# Altium schematic sheet switch_v2.SchDoc
size 406 x 304 mm
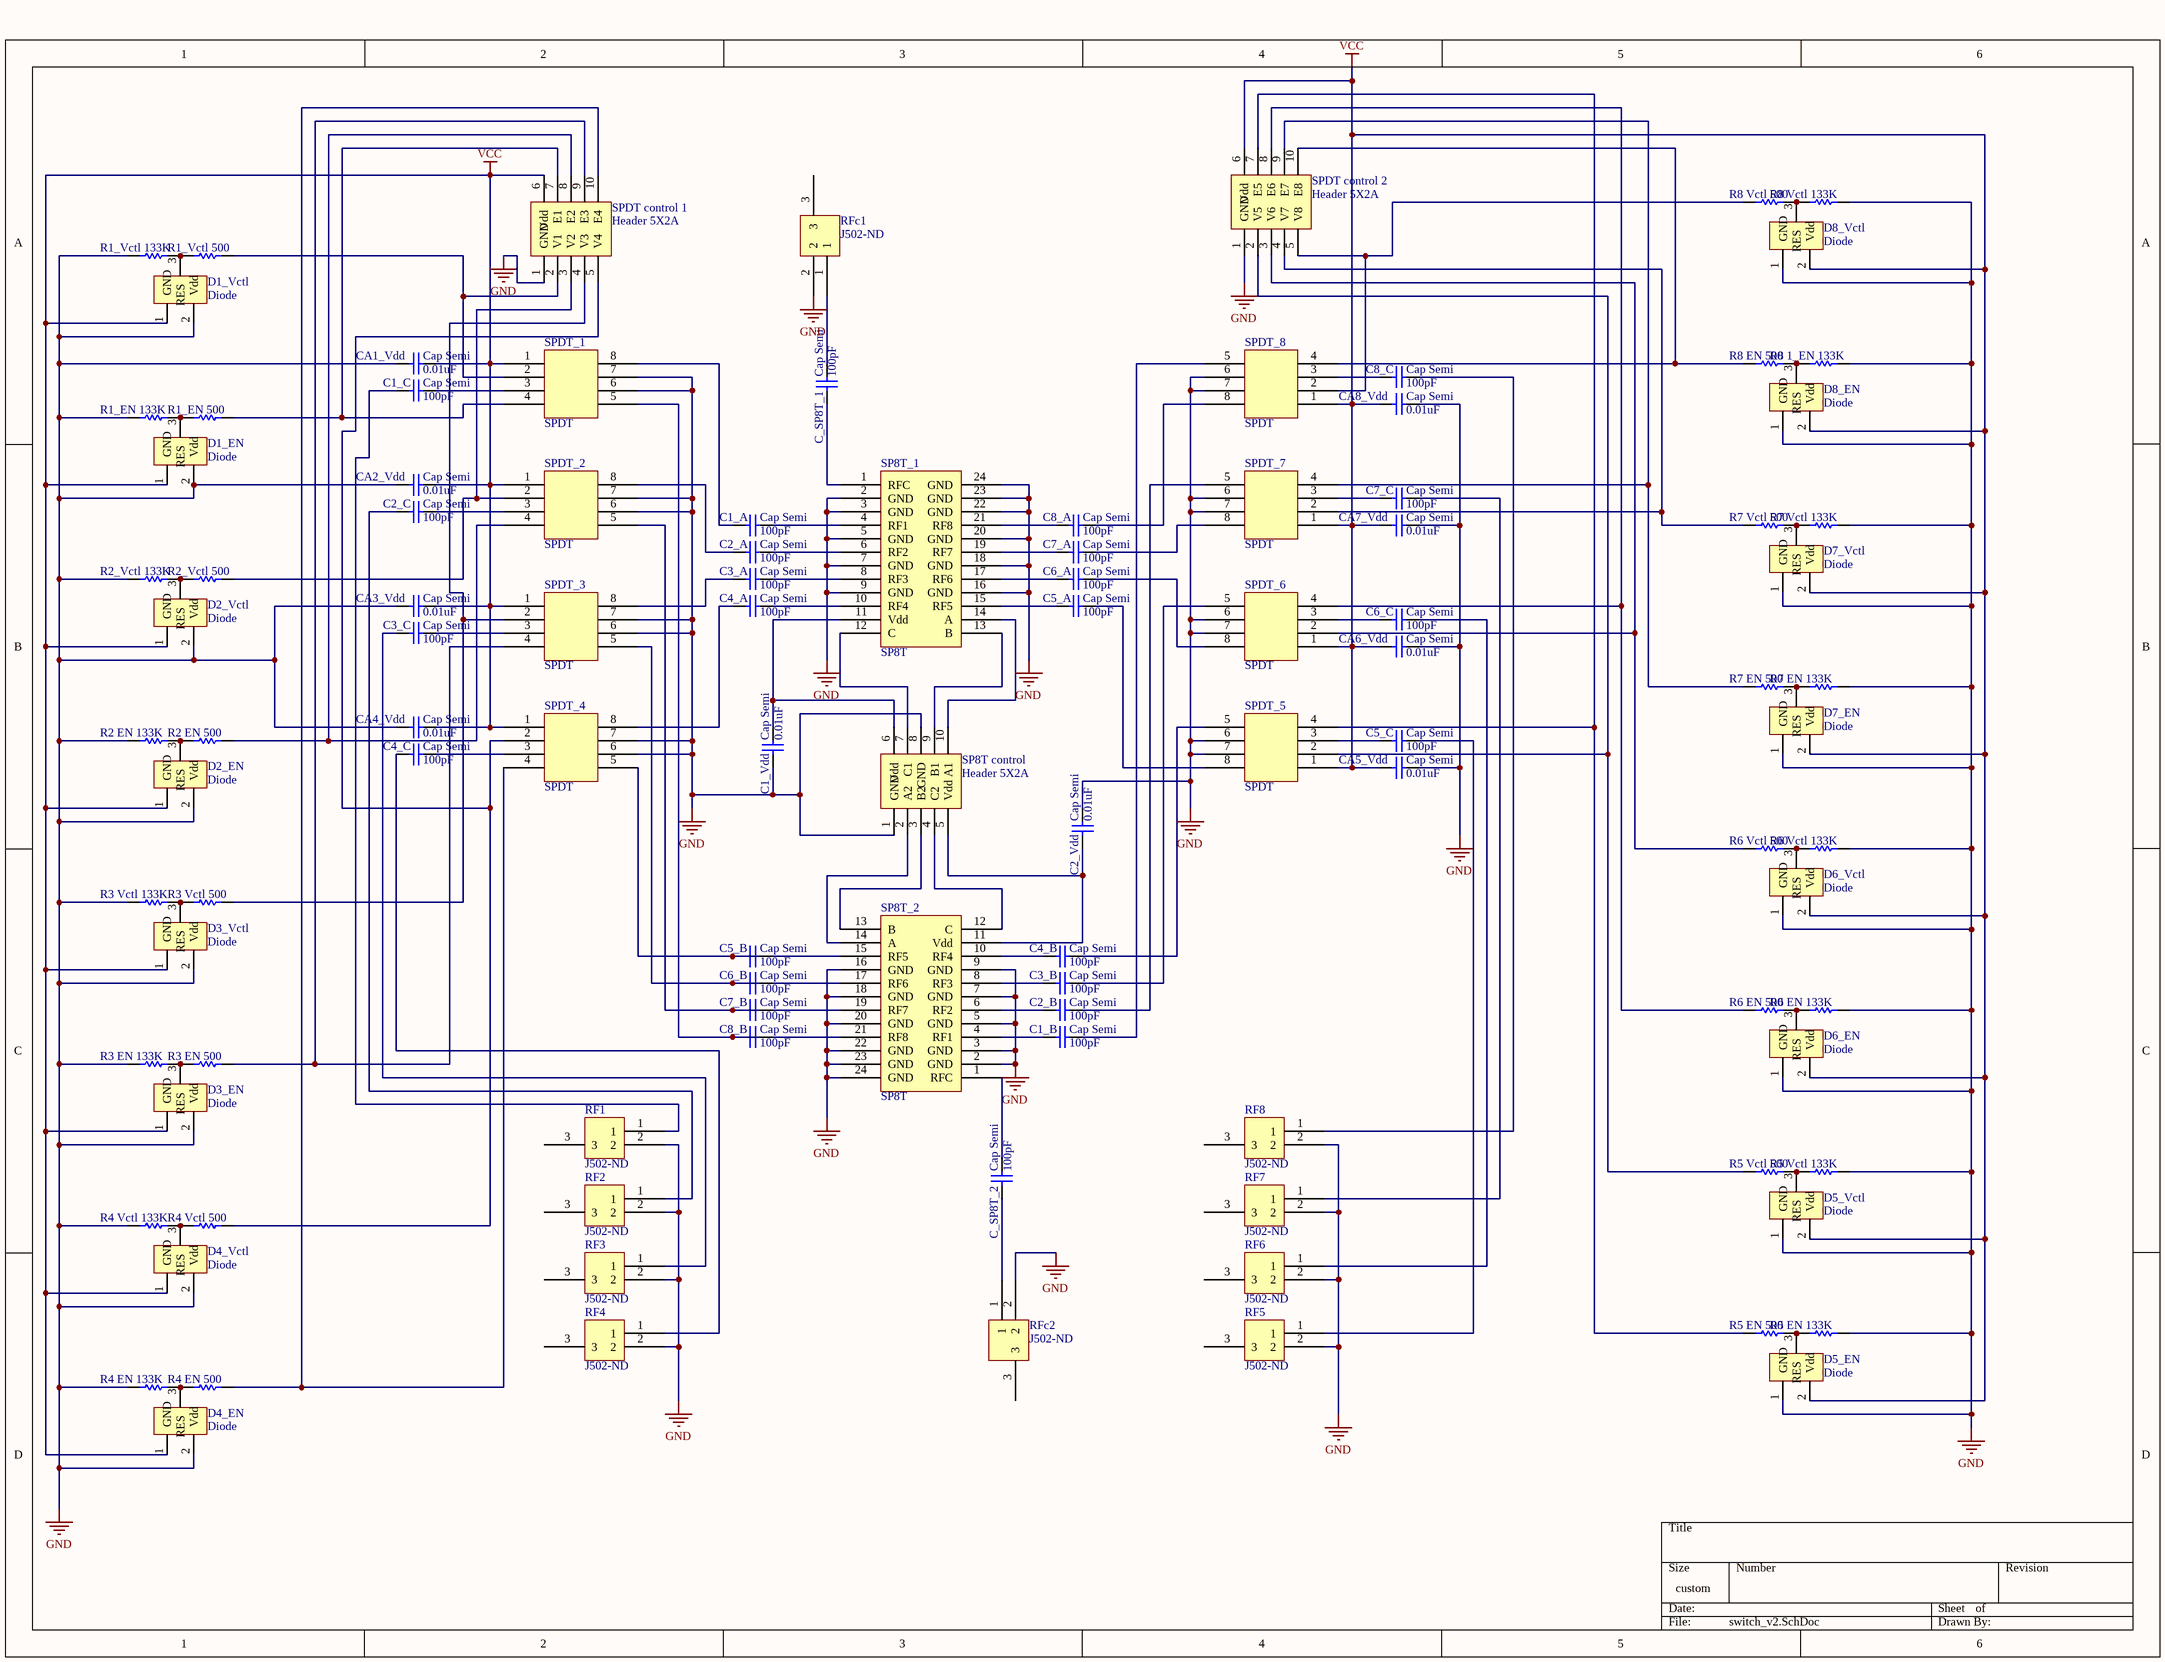
[diagram p0: switch_v2.SchDoc]

## Parts
C1_A  Cap Semi  value 100pF  [0402]
C1_B  Cap Semi  value 100pF  [0402]
C1_C  Cap Semi  value 100pF  [0402]
C1_Vdd  Cap Semi  value 0.01uF  [1608[0603]]
C2_A  Cap Semi  value 100pF  [0402]
C2_B  Cap Semi  value 100pF  [0402]
C2_C  Cap Semi  value 100pF  [0402]
C2_Vdd  Cap Semi  value 0.01uF  [1608[0603]]
C3_A  Cap Semi  value 100pF  [0402]
C3_B  Cap Semi  value 100pF  [0402]
C3_C  Cap Semi  value 100pF  [0402]
C4_A  Cap Semi  value 100pF  [0402]
C4_B  Cap Semi  value 100pF  [0402]
C4_C  Cap Semi  value 100pF  [0402]
C5_A  Cap Semi  value 100pF  [0402]
C5_B  Cap Semi  value 100pF  [0402]
C5_C  Cap Semi  value 100pF  [0402]
C6_A  Cap Semi  value 100pF  [0402]
C6_B  Cap Semi  value 100pF  [0402]
C6_C  Cap Semi  value 100pF  [0402]
C7_A  Cap Semi  value 100pF  [0402]
C7_B  Cap Semi  value 100pF  [0402]
C7_C  Cap Semi  value 100pF  [0402]
C8_A  Cap Semi  value 100pF  [0402]
C8_B  Cap Semi  value 100pF  [0402]
C8_C  Cap Semi  value 100pF  [0402]
C_SP8T_1  Cap Semi  value 100pF  [0402]
C_SP8T_2  Cap Semi  value 100pF  [0402]
CA1_Vdd  Cap Semi  value 0.01uF  [1608[0603]]
CA2_Vdd  Cap Semi  value 0.01uF  [1608[0603]]
CA3_Vdd  Cap Semi  value 0.01uF  [1608[0603]]
CA4_Vdd  Cap Semi  value 0.01uF  [1608[0603]]
CA5_Vdd  Cap Semi  value 0.01uF  [1608[0603]]
CA6_Vdd  Cap Semi  value 0.01uF  [1608[0603]]
CA7_Vdd  Cap Semi  value 0.01uF  [1608[0603]]
CA8_Vdd  Cap Semi  value 0.01uF  [1608[0603]]
D1_EN  Diode  [SOT-23_N]
D1_Vctl  Diode  [SOT-23_N]
D2_EN  Diode  [SOT-23_N]
D2_Vctl  Diode  [SOT-23_N]
D3_EN  Diode  [SOT-23_N]
D3_Vctl  Diode  [SOT-23_N]
D4_EN  Diode  [SOT-23_N]
D4_Vctl  Diode  [SOT-23_N]
D5_EN  Diode  [SOT-23_N]
D5_Vctl  Diode  [SOT-23_N]
D6_EN  Diode  [SOT-23_N]
D6_Vctl  Diode  [SOT-23_N]
D7_EN  Diode  [SOT-23_N]
D7_Vctl  Diode  [SOT-23_N]
D8_EN  Diode  [SOT-23_N]
D8_Vctl  Diode  [SOT-23_N]
R1_EN_133K  (no value)  [0402]
R1_EN_500  (no value)  [0402]
R1_Vctl_133K  (no value)  [0402]
R1_Vctl_500  (no value)  [0402]
R2_EN_133K  (no value)  [0402]
R2_EN_500  (no value)  [0402]
R2_Vctl_133K  (no value)  [0402]
R2_Vctl_500  (no value)  [0402]
R3_EN_133K  (no value)  [0402]
R3_EN_500  (no value)  [0402]
R3_Vctl_133K  (no value)  [0402]
R3_Vctl_500  (no value)  [0402]
R4_EN_133K  (no value)  [0402]
R4_EN_500  (no value)  [0402]
R4_Vctl_133K  (no value)  [0402]
R4_Vctl_500  (no value)  [0402]
R5_EN_133K  (no value)  [0402]
R5_EN_500  (no value)  [0402]
R5_Vctl_133K  (no value)  [0402]
R5_Vctl_500  (no value)  [0402]
R6_EN_133K  (no value)  [0402]
R6_EN_500  (no value)  [0402]
R6_Vctl_133K  (no value)  [0402]
R6_Vctl_500  (no value)  [0402]
R7_EN_133K  (no value)  [0402]
R7_EN_500  (no value)  [0402]
R7_Vctl_133K  (no value)  [0402]
R7_Vctl_500  (no value)  [0402]
R8_1_EN_133K  (no value)  [0402]
R8_EN_500  (no value)  [0402]
R8_Vctl_133K  (no value)  [0402]
R8_Vctl_500  (no value)  [0402]
RF1  J502-ND  [J502-ND]
RF2  J502-ND  [J502-ND]
RF3  J502-ND  [J502-ND]
RF4  J502-ND  [J502-ND]
RF5  J502-ND  [J502-ND]
RF6  J502-ND  [J502-ND]
RF7  J502-ND  [J502-ND]
RF8  J502-ND  [J502-ND]
RFc1  J502-ND  [J502-ND]
RFc2  J502-ND  [J502-ND]
SP8T_1  SP8T  [SP8T]
SP8T_2  SP8T  [SP8T]
SP8T_control  Header 5X2A  [HDR2X5_CEN]
SPDT_1  SPDT  [SPDT]
SPDT_2  SPDT  [SPDT]
SPDT_3  SPDT  [SPDT]
SPDT_4  SPDT  [SPDT]
SPDT_5  SPDT  [SPDT]
SPDT_6  SPDT  [SPDT]
SPDT_7  SPDT  [SPDT]
SPDT_8  SPDT  [SPDT]
SPDT_control_1  Header 5X2A  [HDR2X5_CEN]
SPDT_control_2  Header 5X2A  [HDR2X5_CEN]

## Nets
GND: C1_Vdd.1 C2_Vdd.2 CA1_Vdd.2 CA2_Vdd.2 CA3_Vdd.2 CA4_Vdd.2 CA5_Vdd.1 CA6_Vdd.1 CA7_Vdd.1 CA8_Vdd.1 D1_EN.2(Vdd) D1_Vctl.2(Vdd) D2_EN.2(Vdd) D2_Vctl.2(Vdd) D3_EN.2(Vdd) D3_Vctl.2(Vdd) D4_EN.2(Vdd) D4_Vctl.2(Vdd) D5_EN.1(GND) D5_Vctl.1(GND) D6_EN.1(GND) D6_Vctl.1(GND) D7_EN.1(GND) D7_Vctl.1(GND) D8_EN.1(GND) D8_Vctl.1(GND) R1_EN_133K.1 R1_Vctl_133K.1 R2_EN_133K.1 R2_Vctl_133K.1 R3_EN_133K.1 R3_Vctl_133K.1 R4_EN_133K.1 R4_Vctl_133K.1 R5_EN_133K.2 R5_Vctl_133K.2 R6_EN_133K.2 R6_Vctl_133K.2 R7_EN_133K.2 R7_Vctl_133K.2 R8_1_EN_133K.2 R8_Vctl_133K.2 RF1.2 RF2.2 RF3.2 RF4.2 RF5.2 RF6.2 RF7.2 RF8.2 RFc1.2 RFc2.2 SP8T_1.2(GND) SP8T_1.3(GND) SP8T_1.5(GND) SP8T_1.7(GND) SP8T_1.9(GND) SP8T_1.16(GND) SP8T_1.18(GND) SP8T_1.20(GND) SP8T_1.22(GND) SP8T_1.23(GND) SP8T_1.24(GND) SP8T_2.2(GND) SP8T_2.3(GND) SP8T_2.5(GND) SP8T_2.7(GND) SP8T_2.9(GND) SP8T_2.16(GND) SP8T_2.18(GND) SP8T_2.20(GND) SP8T_2.22(GND) SP8T_2.23(GND) SP8T_2.24(GND) SP8T_control.1(GND) SP8T_control.8(GND) SPDT_1.6(GND) SPDT_1.7(GND) SPDT_2.6(GND) SPDT_2.7(GND) SPDT_3.6(GND) SPDT_3.7(GND) SPDT_4.6(GND) SPDT_4.7(GND) SPDT_5.6(GND) SPDT_5.7(GND) SPDT_6.6(GND) SPDT_6.7(GND) SPDT_7.6(GND) SPDT_7.7(GND) SPDT_8.6(GND) SPDT_8.7(GND) SPDT_control_1.1(GND) SPDT_control_2.1(GND)
VCC: CA1_Vdd.1 CA2_Vdd.1 CA3_Vdd.1 CA4_Vdd.1 CA5_Vdd.2 CA6_Vdd.2 CA7_Vdd.2 CA8_Vdd.2 D1_EN.1(GND) D1_Vctl.1(GND) D2_EN.1(GND) D2_Vctl.1(GND) D3_EN.1(GND) D3_Vctl.1(GND) D4_EN.1(GND) D4_Vctl.1(GND) D5_EN.2(Vdd) D5_Vctl.2(Vdd) D6_EN.2(Vdd) D6_Vctl.2(Vdd) D7_EN.2(Vdd) D7_Vctl.2(Vdd) D8_EN.2(Vdd) D8_Vctl.2(Vdd) SPDT_1.1(Vdd) SPDT_2.1(Vdd) SPDT_3.1(Vdd) SPDT_4.1(Vdd) SPDT_5.1(Vdd) SPDT_6.1(Vdd) SPDT_7.1(Vdd) SPDT_8.1(Vdd) SPDT_control_1.6(Vdd) SPDT_control_2.6(Vdd)
NetC1_A_1: C1_A.1 SPDT_1.8(RF2)
NetC1_A_2: C1_A.2 SP8T_1.4(RF1)
NetC1_B_1: C1_B.1 SP8T_2.4(RF1)
NetC1_B_2: C1_B.2 SPDT_8.5(RF1)
NetC1_C_1: C1_C.1 RF1.1
NetC1_C_2: C1_C.2 SPDT_1.3(RFC)
NetC1_Vdd_2: C1_Vdd.2 SP8T_1.11(Vdd) SP8T_control.6(Vdd)
NetC2_A_1: C2_A.1 SPDT_2.8(RF2)
NetC2_A_2: C2_A.2 SP8T_1.6(RF2)
NetC2_B_1: C2_B.1 SP8T_2.6(RF2)
NetC2_B_2: C2_B.2 SPDT_7.5(RF1)
NetC2_C_1: C2_C.1 RF2.1
NetC2_C_2: C2_C.2 SPDT_2.3(RFC)
NetC2_Vdd_1: C2_Vdd.1 SP8T_2.11(Vdd) SP8T_control.5(Vdd)
NetC3_A_1: C3_A.1 SPDT_3.8(RF2)
NetC3_A_2: C3_A.2 SP8T_1.8(RF3)
NetC3_B_1: C3_B.1 SP8T_2.8(RF3)
NetC3_B_2: C3_B.2 SPDT_6.5(RF1)
NetC3_C_1: C3_C.1 RF3.1
NetC3_C_2: C3_C.2 SPDT_3.3(RFC)
NetC4_A_1: C4_A.1 SPDT_4.8(RF2)
NetC4_A_2: C4_A.2 SP8T_1.10(RF4)
NetC4_B_1: C4_B.1 SP8T_2.10(RF4)
NetC4_B_2: C4_B.2 SPDT_5.5(RF1)
NetC4_C_1: C4_C.1 RF4.1
NetC4_C_2: C4_C.2 SPDT_4.3(RFC)
NetC5_A_1: C5_A.1 SP8T_1.15(RF5)
NetC5_A_2: C5_A.2 SPDT_5.8(RF2)
NetC5_B_1: C5_B.1 SPDT_4.5(RF1)
NetC5_B_2: C5_B.2 SP8T_2.15(RF5)
NetC5_C_1: C5_C.1 SPDT_5.3(RFC)
NetC5_C_2: C5_C.2 RF5.1
NetC6_A_1: C6_A.1 SP8T_1.17(RF6)
NetC6_A_2: C6_A.2 SPDT_6.8(RF2)
NetC6_B_1: C6_B.1 SPDT_3.5(RF1)
NetC6_B_2: C6_B.2 SP8T_2.17(RF6)
NetC6_C_1: C6_C.1 SPDT_6.3(RFC)
NetC6_C_2: C6_C.2 RF6.1
NetC7_A_1: C7_A.1 SP8T_1.19(RF7)
NetC7_A_2: C7_A.2 SPDT_7.8(RF2)
NetC7_B_1: C7_B.1 SPDT_2.5(RF1)
NetC7_B_2: C7_B.2 SP8T_2.19(RF7)
NetC7_C_1: C7_C.1 SPDT_7.3(RFC)
NetC7_C_2: C7_C.2 RF7.1
NetC8_A_1: C8_A.1 SP8T_1.21(RF8)
NetC8_A_2: C8_A.2 SPDT_8.8(RF2)
NetC8_B_1: C8_B.1 SPDT_1.5(RF1)
NetC8_B_2: C8_B.2 SP8T_2.21(RF8)
NetC8_C_1: C8_C.1 SPDT_8.3(RFC)
NetC8_C_2: C8_C.2 RF8.1
NetC_SP8T_1_1: C_SP8T_1.1 SP8T_1.1(RFC)
NetC_SP8T_1_2: C_SP8T_1.2 RFc1.1
NetC_SP8T_2_1: C_SP8T_2.1 RFc2.1
NetC_SP8T_2_2: C_SP8T_2.2 SP8T_2.1(RFC)
NetD1_EN_3: D1_EN.3(RES) R1_EN_133K.2 R1_EN_500.1
NetD1_Vctl_3: D1_Vctl.3(RES) R1_Vctl_133K.2 R1_Vctl_500.1
NetD2_EN_3: D2_EN.3(RES) R2_EN_133K.2 R2_EN_500.1
NetD2_Vctl_3: D2_Vctl.3(RES) R2_Vctl_133K.2 R2_Vctl_500.1
NetD3_EN_3: D3_EN.3(RES) R3_EN_133K.2 R3_EN_500.1
NetD3_Vctl_3: D3_Vctl.3(RES) R3_Vctl_133K.2 R3_Vctl_500.1
NetD4_EN_3: D4_EN.3(RES) R4_EN_133K.2 R4_EN_500.1
NetD4_Vctl_3: D4_Vctl.3(RES) R4_Vctl_133K.2 R4_Vctl_500.1
NetD5_EN_3: D5_EN.3(RES) R5_EN_133K.1 R5_EN_500.2
NetD5_Vctl_3: D5_Vctl.3(RES) R5_Vctl_133K.1 R5_Vctl_500.2
NetD6_EN_3: D6_EN.3(RES) R6_EN_133K.1 R6_EN_500.2
NetD6_Vctl_3: D6_Vctl.3(RES) R6_Vctl_133K.1 R6_Vctl_500.2
NetD7_EN_3: D7_EN.3(RES) R7_EN_133K.1 R7_EN_500.2
NetD7_Vctl_3: D7_Vctl.3(RES) R7_Vctl_133K.1 R7_Vctl_500.2
NetD8_EN_3: D8_EN.3(RES) R8_1_EN_133K.1 R8_EN_500.2
NetD8_Vctl_3: D8_Vctl.3(RES) R8_Vctl_133K.1 R8_Vctl_500.2
NetR1_EN_500_2: R1_EN_500.2 SPDT_1.4(EN) SPDT_control_1.7(E1)
NetR1_Vctl_500_2: R1_Vctl_500.2 SPDT_1.2(Vctl) SPDT_control_1.2(V1)
NetR2_EN_500_2: R2_EN_500.2 SPDT_2.4(EN) SPDT_control_1.8(E2)
NetR2_Vctl_500_2: R2_Vctl_500.2 SPDT_2.2(Vctl) SPDT_control_1.3(V2)
NetR3_EN_500_2: R3_EN_500.2 SPDT_3.4(EN) SPDT_control_1.9(E3)
NetR3_Vctl_500_2: R3_Vctl_500.2 SPDT_3.2(Vctl) SPDT_control_1.4(V3)
NetR4_EN_500_2: R4_EN_500.2 SPDT_4.4(EN) SPDT_control_1.10(E4)
NetR4_Vctl_500_2: R4_Vctl_500.2 SPDT_4.2(Vctl) SPDT_control_1.5(V4)
NetR5_EN_500_1: R5_EN_500.1 SPDT_5.4(EN) SPDT_control_2.7(E5)
NetR5_Vctl_500_1: R5_Vctl_500.1 SPDT_5.2(Vctl) SPDT_control_2.2(V5)
NetR6_EN_500_1: R6_EN_500.1 SPDT_6.4(EN) SPDT_control_2.8(E6)
NetR6_Vctl_500_1: R6_Vctl_500.1 SPDT_6.2(Vctl) SPDT_control_2.3(V6)
NetR7_EN_500_1: R7_EN_500.1 SPDT_7.4(EN) SPDT_control_2.9(E7)
NetR7_Vctl_500_1: R7_Vctl_500.1 SPDT_7.2(Vctl) SPDT_control_2.4(V7)
NetR8_EN_500_1: R8_EN_500.1 SPDT_8.4(EN) SPDT_control_2.10(E8)
NetR8_Vctl_500_1: R8_Vctl_500.1 SPDT_8.2(Vctl) SPDT_control_2.5(V8)
NetSP8T_1_12: SP8T_1.12(C) SP8T_control.7(C1)
NetSP8T_1_13: SP8T_1.13(B) SP8T_control.9(B1)
NetSP8T_1_14: SP8T_1.14(A) SP8T_control.10(A1)
NetSP8T_2_12: SP8T_2.12(C) SP8T_control.4(C2)
NetSP8T_2_13: SP8T_2.13(B) SP8T_control.3(B2)
NetSP8T_2_14: SP8T_2.14(A) SP8T_control.2(A2)

Not connected (* = marked no-connect by the designer): RF1 3; RF2 3; RF3 3; RF4 3; RF5 3; RF6 3; RF7 3; RF8 3; RFc1 3; RFc2 3

## Library data of the parts
C1_A C1_B C1_C C1_Vdd C2_A C2_B C2_C C2_Vdd C3_A C3_B C3_C C4_A C4_B C4_C C5_A C5_B C5_C C6_A C6_B C6_C C7_A C7_B C7_C C8_A C8_B C8_C C_SP8T_1 C_SP8T_2 CA1_Vdd CA2_Vdd CA3_Vdd CA4_Vdd CA5_Vdd CA6_Vdd CA7_Vdd CA8_Vdd = Cap Semi: Capacitor (Semiconductor SIM Model); Published: 8-Jun-2000; LatestRevisionDate: 29-May-2009; LatestRevisionNote: IPC-7351 Footprint Added.; PackageReference: C1206; Publisher: Altium Limited; PackageDescription: Chip Capacitor
R1_EN_133K R1_EN_500 R1_Vctl_133K R1_Vctl_500 R2_EN_133K R2_EN_500 R2_Vctl_133K R2_Vctl_500 R3_EN_133K R3_EN_500 R3_Vctl_133K R3_Vctl_500 R4_EN_133K R4_EN_500 R4_Vctl_133K R4_Vctl_500 R5_EN_133K R5_EN_500 R5_Vctl_133K R5_Vctl_500 R6_EN_133K R6_EN_500 R6_Vctl_133K R6_Vctl_500 R7_EN_133K R7_EN_500 R7_Vctl_133K R7_Vctl_500 R8_1_EN_133K R8_EN_500 R8_Vctl_133K R8_Vctl_500 = Res1: Resistor; Published: 8-Jun-2000; LatestRevisionDate: 17-Jul-2002; LatestRevisionNote: Re-released for DXP Platform.; PackageReference: AXIAL-0.3; Publisher: Altium Limited; PackageDescription: Axial Device, Thru-Hole; 2 Leads; 0.3 in Pin Spacing
SP8T_control SPDT_control_1 SPDT_control_2 = Header 5X2A: Header, 5-Pin, Dual row; LatestRevisionDate: 17-Jul-2002; LatestRevisionNote: Re-released for DXP Platform.; Publisher: Altium Limited